# Altium schematic sheet battery_monitor_4S_thru_hole.schdoc
size A4; SheetNumber: 1; SheetTotal: 1
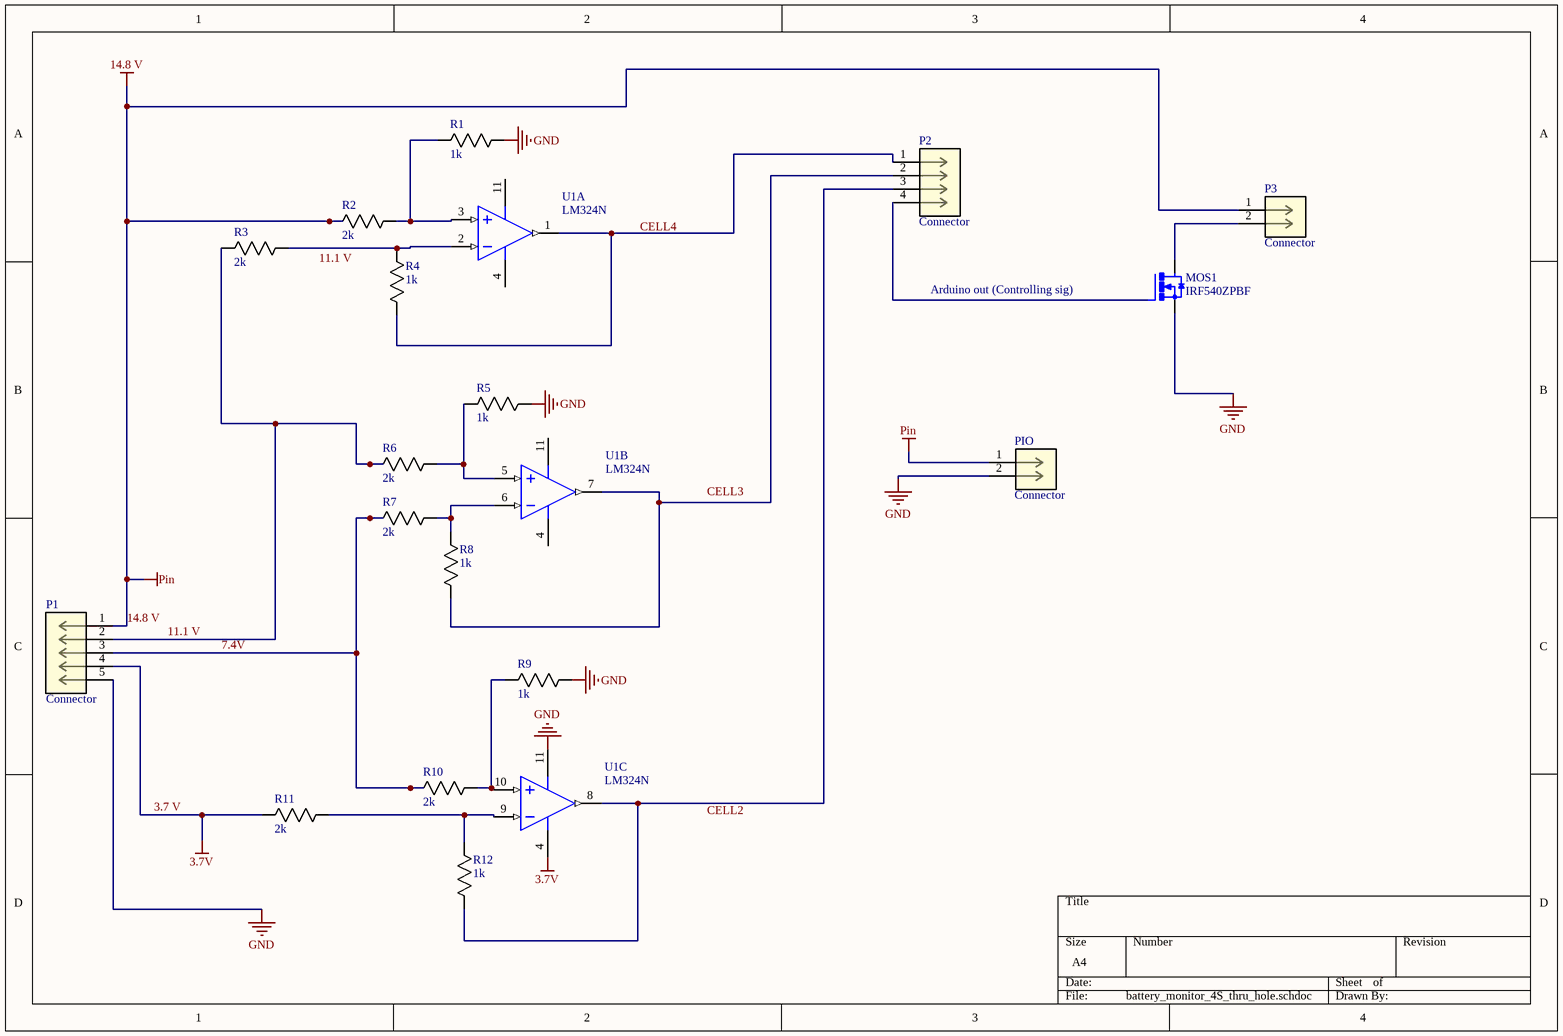
[diagram p0: battery_monitor_4S_thru_hole.schdoc]

## Parts
MOS1  IRF540ZPBF  [TO220]
P1  Connector  [CONN_B5B-PH-K-SLFSN_JST]
P2  Connector  [CONN_B4B-XH-A_JST]
P3  Connector  [CONN_B2B-XH-A_JST]
PIO  Connector  [CONN_B2B-XH-A_JST]
R1  1k  [STA_CF14_STP]
R2  2k  [STA_CF14_STP]
R3  2k  [STA_CF14_STP]
R4  1k  [STA_CF14_STP]
R5  1k  [STA_CF14_STP]
R6  2k  [STA_CF14_STP]
R7  2k  [STA_CF14_STP]
R8  1k  [STA_CF14_STP]
R9  1k  [STA_CF14_STP]
R10  2k  [STA_CF14_STP]
R11  2k  [STA_CF14_STP]
R12  1k  [STA_CF14_STP]
U1  LM324N  [N0014A]  (parts A,B,C of 4)

## Nets
3.7 V: P1.4 R11.1 U1.4(V+)  [also labelled 3.7V]
14.8 V: P1.1 P3.1 PIO.1 R2.1  [also labelled Pin]
GND: MOS1.3(S) P1.5 PIO.2 R1.2 R5.2 R9.2 U1.11(GND)
7.4V: P1.3 R7.1 R10.1
11.1 V: P1.2 R3.1 R6.1
NetMOS1_1: MOS1.1(G) P2.4
NetMOS1_2: MOS1.2(D) P3.2
NetP2_1: P2.1 R4.1 U1.1(OUT1)
NetP2_2: P2.2 R8.1 U1.7(OUT2)
NetP2_3: P2.3 R12.1 U1.8(OUT3)
NetR1_1: R1.1 R2.2 U1.3(IN1+)
NetR3_2: R3.2 R4.2 U1.2(IN1-)
NetR5_1: R5.1 R6.2 U1.5(IN2+)
NetR7_2: R7.2 R8.2 U1.6(IN2-)
NetR9_1: R9.1 R10.2 U1.10(IN3+)
NetR11_2: R11.2 R12.2 U1.9(IN3-)

## Notes on the sheet
- (near MOS1) Arduino out (Controlling sig)
- Labels drawn without touching a wire or pin: 11.1 V, CELL2, CELL3, CELL4

## Library data of the parts
MOS1 = IRF540ZPBF: Power Field-Effect Transistor, 36A I(D), 100V, 0.0265ohm, 1-Element, N-Channel, Silicon, Metal-oxide Semiconductor FET, TO-220AB; Manufacturer: Infineon; Package Body Material: Plastic; Avalanche Energy Rating (Eas): 120mJ; Case Connection: DRAIN; Drain-source On Resistance-Max: 26.5mR; Number of Elements: 1; Operating Mode: ENHANCEMENT MODE; Pulsed Drain Current-Max (IDM): 140A; Surface Mount: No; Transistor Application: SWITCHING; Drain Current-Max (Abs) (ID): 34A; Power Dissipation-Max (Abs): 91W; Time @ Peak Reflow Temperature-Max (s): 30s; Qualification Status: Not Qualified; Supplier: Digikey; Supplier Part Number: IRF540ZPBF-ND; Manufacturer Part Number: IRF540ZPBF; RoHS: Yes; Category: MOSFETs; Stock: 39079; Pricing: 1=1.22, 50=0.9822, 100=0.7784, 500=0.6598, 1000=0.53747, 2000=0.50597, 5000=0.48187, 10000=0.45963 (USD); Pins: 3; Package Shape: Rectangular; Transistor Element Material: SILICON; Terminal Finish: Tin; Max Operating Temperature: 175°C; Polarity/Channel Type: N-CHANNEL; Drain Current-Max (ID): 36A; DS Breakdown Voltage-Min: 100V; FET Technology: METAL-OXIDE SEMICONDUCTOR; JESD-30 Code: R-PSFM-T3; Package Style: FLANGE MOUNTMeter; Terminal Form: Through Hole; Terminal Position: SINGLE; JESD-609 Code: e3; Peak Reflow Temperature (Cel): 250°C; JEDEC-95 Code: TO-220AB; RoHS Compliant: Yes; Reach SVHC Compliant: Yes; ComponentLink1URL: https://datasheet.ciiva.com:443/pdfs/VipMasterIC/IC/IRSD/IRSDS18787/IRSDS18787-1.pdf?src-supplier=IHS+Markit; ComponentLink1Description: https://datasheet.ciiva.com:443/pdfs/VipMasterIC/IC/IRSD/IRSDS18787/IRSDS18787-1.pdf?src-supplier=IHS+Markit; ComponentLink2URL: http://www.farnell.com/datasheets/695950.pdf?src-supplier=Farnell; ComponentLink2Description: http://www.farnell.com/datasheets/695950.pdf?src-supplier=Farnell; ComponentLink3URL: https://www.alliedelec.com/m/d/9b69e5f77608fdb1ac970df3f21c25ae.pdf?src-supplier=Allied+Electronics; ComponentLink3Description: https://www.alliedelec.com/m/d/9b69e5f77608fdb1ac970df3f21c25ae.pdf?src-supplier=Allied+Electronics; ComponentLink4URL: http://www.irf.com/product-info/datasheets/data/irf540z.pdf?src-supplier=Digikey; ComponentLink4Description: http://www.irf.com/product-info/datasheets/data/irf540z.pdf?src-supplier=Digikey; ComponentLink5URL: http://datasheet.octopart.com/IRF540ZPBF-Infineon-datasheet-10898051.pdf?src-supplier=Avnet; ComponentLink5Description: http://datasheet.octopart.com/IRF540ZPBF-Infineon-datasheet-10898051.pdf?src-supplier=Avnet; ComponentLink6URL: https://datasheet.octopart.com/IRF540Z-International-Rectifier-datasheet-4648.pdf?src-supplier=Newark; ComponentLink6Description: https://datasheet.octopart.com/IRF540Z-International-Rectifier-datasheet-4648.pdf?src-supplier=Newark; ComponentLink7URL: https://datasheet.octopart.com/IRF540ZPBF-Infineon-datasheet-8102946.pdf?src-supplier=Element14; ComponentLink7Description: https://datasheet.octopart.com/IRF540ZPBF-Infineon-datasheet-8102946.pdf?src-supplier=Element14; ComponentLink8URL: http://datasheet.octopart.com/IRF540ZPBF-Infineon-datasheet-10898051.pdf?src-supplier=Rs; ComponentLink8Description: http://datasheet.octopart.com/IRF540ZPBF-Infineon-datasheet-10898051.pdf?src-supplier=Rs; ComponentLink9URL: http://datasheet.octopart.com/IRF540ZPBF-Infineon-datasheet-10898051.pdf?src-supplier=Mouser; ComponentLink9Description: http://datasheet.octopart.com/IRF540ZPBF-Infineon-datasheet-10898051.pdf?src-supplier=Mouser; ComponentLink10URL: http://datasheet.octopart.com/IRF540ZPBF-Infineon-datasheet-10898051.pdf?src-supplier=Future+Electronics; ComponentLink10Description: http://datasheet.octopart.com/IRF540ZPBF-Infineon-datasheet-10898051.pdf?src-supplier=Future+Electronics; ComponentLink11URL: http://datasheet.octopart.com/IRF540ZPBF-Infineon-datasheet-10898051.pdf?src-supplier=TME; ComponentLink11Description: http://datasheet.octopart.com/IRF540ZPBF-Infineon-datasheet-10898051.pdf?src-supplier=TME; ComponentLink12URL: http://datasheet.octopart.com/IRF540ZPBF-Infineon-datasheet-10898051.pdf?src-supplier=Quest; ComponentLink12Description: http://datasheet.octopart.com/IRF540ZPBF-Infineon-datasheet-10898051.pdf?src-supplier=Quest
P1 = B5B-PH-K-S: CONN HEADER VERT 5POS 2MM; Manufacturer: JST; Supplier: Digikey; Supplier Part Number: 455-1707-ND; Manufacturer Part Number: B5B-PH-K-S; RoHS: Yes; Category: Connectors; Stock: 427072; Pricing: 1=0.31, 10=0.268, 100=0.2084, 500=0.1786, 1000=0.14883, 5000=0.12757, 10000=0.11906 (USD); ComponentLink1URL: https://datasheet.ciiva.com/6905/phseries-6905849.pdf?src-supplier=Digikey; ComponentLink1Description: https://datasheet.ciiva.com/6905/phseries-6905849.pdf?src-supplier=Digikey
P2 = B4B-XH-A: Header B4B-XH-A, 2.50mm, 4-contacts, top entry, THT /500/box; Manufacturer: JST; Supplier: Digikey; Supplier Part Number: 455-B4B-XH-A-ND; Manufacturer Part Number: B4B-XH-A; RoHS: Yes; Category: FFC / FPC; Stock: 324702; Pricing: 1=0.23, 10=0.19, 100=0.1465, 500=0.12392, 1000=0.10139, 5000=0.09013, 10000=0.08168 (USD); ComponentLink1URL: https://datasheet.ciiva.com/14155/xh-series-eng-tds-14155433.pdf?src-supplier=Distrelec; ComponentLink1Description: https://datasheet.ciiva.com/14155/xh-series-eng-tds-14155433.pdf?src-supplier=Distrelec
P3 PIO = B2B-XH-A: Header B2B-XH-A, 2.50mm, 2-contacts, top entry, THT /1000/box; Manufacturer: JST; Supplier: Digikey; Supplier Part Number: 455-B2B-XH-A-ND; Manufacturer Part Number: B2B-XH-A; RoHS: Yes; Category: FFC / FPC; Stock: 990478; Pricing: 1=0.15, 10=0.122, 100=0.0898, 500=0.07432, 1000=0.06502, 5000=0.05573, 10000=0.05419 (USD); ComponentLink1URL: https://www.distrelec.biz/Web/Downloads/_t/ds/xh-series_eng_tds.pdf?mime=application%2Fpdf&src-supplier=Distrelec; ComponentLink1Description: https://www.distrelec.biz/Web/Downloads/_t/ds/xh-series_eng_tds.pdf?mime=application%2Fpdf&src-supplier=Distrelec
R1-R12 = CF14JT1K00: Fixed Resistor, Carbon Film, 0.25W, 1000ohm, 350V, 5% +/-Tol, -400,0ppm/Cel, Through Hole Mount; Manufacturer: Stackpole Electronics; Power: 250mW; Rated Temperature: 70°C; Value: 1kR; Temperature Coefficient: 400ppm/°C; Lead Diameter: 0.55mm; Lead Length: 28mm; Package Diameter: 2.3mm; Package Length: 6mm; Supplier: Digikey; Supplier Part Number: CF14JT1K00CT-ND; Manufacturer Part Number: CF14JT1K00; RoHS: Yes; Category: Through-Hole Resistors; Stock: 1012460; Pricing: 1=0.1, 10=0.053, 25=0.0404, 50=0.0308, 100=0.0215, 250=0.01728, 500=0.01382, 1000=0.01017 (USD); Mounting Technology: Through Hole; Pins: 2; Package Shape: Tubular; Terminal Finish: Tin; Min Operating Temperature: -55°C; Max Operating Temperature: 155°C; Tolerance: 5%; JESD-609 Code: e3; Resistor Type: FIXED RESISTOR; Construction: Tubular; Package Style: AxialMeter; Packaging: Tape and Reel; Technology: CARBON FILM; Termination: Wire; Working Voltage: 350V; Reach SVHC Compliant: Yes; RoHS Compliant: Yes; ComponentLink1URL: https://datasheet.ciiva.com:443/pdfs/VipMasterIC/IC/SEIE/SEIE-S-A0009883960/SEIE-S-A0009883960-1.pdf?src-supplier=IHS+Markit; ComponentLink1Description: https://datasheet.ciiva.com:443/pdfs/VipMasterIC/IC/SEIE/SEIE-S-A0009883960/SEIE-S-A0009883960-1.pdf?src-supplier=IHS+Markit; ComponentLink2URL: https://www.seielect.com/catalog/SEI-Packaging.pdf?src-supplier=Digikey; ComponentLink2Description: https://www.seielect.com/catalog/SEI-Packaging.pdf?src-supplier=Digikey; ComponentLink3URL: https://www.seielect.com/Catalog/SEI-CF_CFM.pdf?src-supplier=Digikey; ComponentLink3Description: https://www.seielect.com/Catalog/SEI-CF_CFM.pdf?src-supplier=Digikey; ComponentLink4URL: http://www.seielect.com/Catalog/SEI-CF_CFM.pdf?src-supplier=Future+Electronics; ComponentLink4Description: http://www.seielect.com/Catalog/SEI-CF_CFM.pdf?src-supplier=Future+Electronics; ComponentLink5URL: https://www.seielect.com/catalog/SEI-CF_CFM.pdf?src-supplier=Avnet; ComponentLink5Description: https://www.seielect.com/catalog/SEI-CF_CFM.pdf?src-supplier=Avnet; ComponentLink6URL: http://components.arrow.com/part/dataview/27620077S9848643N1174?src-supplier=Arrow+Electronics; ComponentLink6Description: http://components.arrow.com/part/dataview/27620077S9848643N1174?src-supplier=Arrow+Electronics; ComponentLink7URL: https://www.verical.com/server-webapp/html/getDatasheet?partID=360403&src-supplier=Verical; ComponentLink7Description: https://www.verical.com/server-webapp/html/getDatasheet?partID=360403&src-supplier=Verical
U1 = LM324N: Operational Amplifier, 4 Func, 9000uV Offset-Max, BIPolar, PDIP14; Manufacturer: Texas Instruments; Package Body Material: Plastic; Architecture: VOLTAGE-FEEDBACK; Average Bias Current-Max (IIB): 500nA; Bias Current-Max (IIB) @25C: 250nA; Common-mode Reject Ratio-Nom: 85dB; Frequency Compensation: YES; Input Offset Voltage-Max: 9mV; Low-Offset: No; Channels: 4; Package Equivalence Code: DIP14,.3; Power Supplies: 5/30V; Max Supply Current: 1.2mA; Supply Voltage Limit-Max: 32V; Nominal Supply Voltage: 5V; Surface Mount: No; Unity Gain BW-Nom: 1MHz; Voltage Gain-Min: 25000; Neg Supply Voltage Limit-Max: 0V; Slew Rate: 0.5V/µs; Time @ Peak Reflow Temperature-Max (s): 40s; Common Mode Rejection Ratio-Min: 65dB; Qualification Status: Not Qualified; Supplier: Digikey; Supplier Part Number: 296-1391-5-ND; Manufacturer Part Number: LM324N; RoHS: No; Category: Amplifiers - Op Amps, Buffer, Instrumentation; Stock: 18473; Pricing: 1=0.44, 10=0.375, 25=0.35, 100=0.28, 250=0.25996, 500=0.21998, 1000=0.16998, 2500=0.15498, 5000=0.14499 (USD); Case/Package: DIP; Pins: 14; Package Shape: Rectangular; Terminal Finish: Tin; Min Operating Temperature: 0°C; Max Operating Temperature: 70°C; Amplifier Type: OPERATIONAL AMPLIFIER; JESD-30 Code: R-PDIP-T14; Micropower: Yes; Package Style: IN-LINEMeter; Technology: BIPOLAR; Terminal Form: Through Hole; Terminal Position: DUAL; JESD-609 Code: e0; Peak Reflow Temperature (Cel): 260°C; Neg Supply Voltage-Nom (Vsup): 0V; Length: 19.18mm; Width: 7.62mm; Height - Seated (Max): 5.08mm; Terminal Pitch: 2.54mm; Temperature Grade: COMMERCIAL; RoHS Compliant: No; Reach SVHC Compliant: No; ComponentLink1URL: https://datasheet.ciiva.com:443/pdfs/VipMasterIC/IC/NATL/NATLS09708/NATLS09708-1.pdf?src-supplier=IHS+Markit; ComponentLink1Description: https://datasheet.ciiva.com:443/pdfs/VipMasterIC/IC/NATL/NATLS09708/NATLS09708-1.pdf?src-supplier=IHS+Markit; ComponentLink2URL: https://datasheet.ciiva.com/5997/1768103-5997424.pdf?src-supplier=Farnell; ComponentLink2Description: https://datasheet.ciiva.com/5997/1768103-5997424.pdf?src-supplier=Farnell; ComponentLink3URL: https://datasheet.ciiva.com/1796/lm224-1796723.pdf?src-supplier=Digikey; ComponentLink3Description: https://datasheet.ciiva.com/1796/lm224-1796723.pdf?src-supplier=Digikey; ComponentLink4URL: https://datasheet.ciiva.com/7148/lm224-7148869.pdf?src-supplier=Newark; ComponentLink4Description: https://datasheet.ciiva.com/7148/lm224-7148869.pdf?src-supplier=Newark; ComponentLink5URL: https://datasheet.ciiva.com/7709/1840878-7709815.pdf?src-supplier=Element14; ComponentLink5Description: https://datasheet.ciiva.com/7709/1840878-7709815.pdf?src-supplier=Element14; ComponentLink6URL: https://datasheet.ciiva.com/7709/1840878-7709816.pdf?src-supplier=Element14; ComponentLink6Description: https://datasheet.ciiva.com/7709/1840878-7709816.pdf?src-supplier=Element14; ComponentLink7URL: https://datasheet.ciiva.com/8008/1905671-8008853.pdf?src-supplier=Element14; ComponentLink7Description: https://datasheet.ciiva.com/8008/1905671-8008853.pdf?src-supplier=Element14